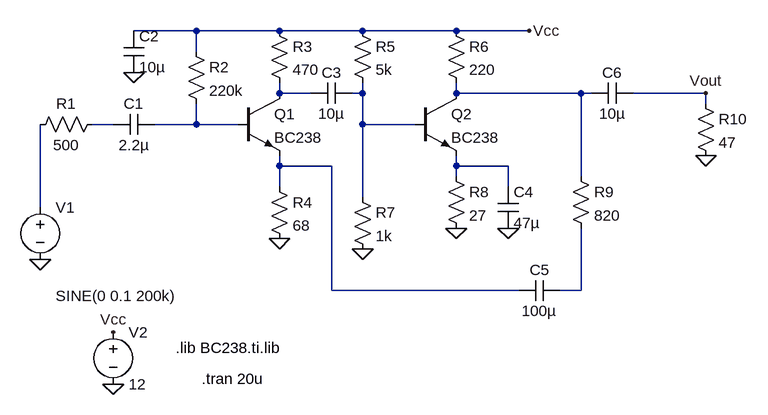
[diagram p0: schematic ECDLab4.asc]
ECDLab4.asc, the LTspice schematic file:
Version 4
SHEET 1 175648 24656
WIRE 174288 24048 174192 24048
WIRE 174416 24048 174288 24048
WIRE 174544 24048 174416 24048
WIRE 174688 24048 174544 24048
WIRE 174800 24048 174688 24048
WIRE 174288 24080 174288 24048
WIRE 174416 24144 174416 24128
WIRE 174464 24144 174416 24144
WIRE 174544 24144 174544 24128
WIRE 174544 24144 174528 24144
WIRE 174688 24144 174688 24128
WIRE 174880 24144 174688 24144
WIRE 174896 24144 174880 24144
WIRE 175072 24144 174960 24144
WIRE 175072 24160 175072 24144
WIRE 174160 24192 174128 24192
WIRE 174288 24192 174288 24160
WIRE 174288 24192 174224 24192
WIRE 174352 24192 174288 24192
WIRE 174544 24192 174544 24144
WIRE 174624 24192 174544 24192
WIRE 174416 24256 174416 24240
WIRE 174496 24256 174416 24256
WIRE 174688 24256 174688 24240
WIRE 174768 24256 174688 24256
WIRE 174688 24272 174688 24256
WIRE 174880 24272 174880 24144
WIRE 174416 24288 174416 24256
WIRE 174768 24288 174768 24256
WIRE 174544 24304 174544 24192
WIRE 174048 24320 174048 24192
WIRE 174496 24448 174496 24256
WIRE 174784 24448 174496 24448
WIRE 174880 24448 174880 24352
WIRE 174880 24448 174848 24448
FLAG 174192 24112 0
FLAG 174416 24368 0
FLAG 174544 24384 0
FLAG 174768 24352 0
FLAG 174688 24352 0
FLAG 175072 24144 Vout
FLAG 174800 24048 Vcc
FLAG 174160 24592 0
FLAG 174160 24512 Vcc
FLAG 175072 24240 0
FLAG 174048 24400 0
SYMBOL res 174144 24176 R90
WINDOW 0 0 56 VBottom 2
WINDOW 3 32 56 VTop 2
SYMATTR InstName R1
SYMATTR Value 500
SYMBOL cap 174224 24176 R90
WINDOW 0 0 32 VBottom 2
WINDOW 3 32 32 VTop 2
SYMATTR InstName C1
SYMATTR Value 2.2µ
SYMBOL cap 174176 24048 R0
SYMATTR InstName C2
SYMATTR Value 10µ
SYMBOL res 174400 24032 R0
SYMATTR InstName R3
SYMATTR Value 470
SYMBOL npn 174352 24144 R0
SYMATTR InstName Q1
SYMATTR Value BC238
SYMBOL res 174400 24272 R0
SYMATTR InstName R4
SYMATTR Value 68
SYMBOL cap 174528 24128 R90
WINDOW 0 0 32 VBottom 2
WINDOW 3 32 32 VTop 2
SYMATTR InstName C3
SYMATTR Value 10µ
SYMBOL res 174528 24032 R0
SYMATTR InstName R5
SYMATTR Value 5k
SYMBOL res 174672 24032 R0
SYMATTR InstName R6
SYMATTR Value 220
SYMBOL npn 174624 24144 R0
SYMATTR InstName Q2
SYMATTR Value BC238
SYMBOL res 174528 24288 R0
SYMATTR InstName R7
SYMATTR Value 1k
SYMBOL res 174672 24256 R0
SYMATTR InstName R8
SYMATTR Value 27
SYMBOL cap 174752 24288 R0
SYMATTR InstName C4
SYMATTR Value 47µ
SYMBOL cap 174960 24128 R90
WINDOW 0 0 32 VBottom 2
WINDOW 3 32 32 VTop 2
SYMATTR InstName C6
SYMATTR Value 10µ
SYMBOL voltage 174160 24496 R0
WINDOW 123 0 0 Left 0
WINDOW 39 0 0 Left 0
SYMATTR InstName V2
SYMATTR Value 12
SYMBOL cap 174848 24432 R90
WINDOW 0 0 32 VBottom 2
WINDOW 3 32 32 VTop 2
SYMATTR InstName C5
SYMATTR Value 100µ
SYMBOL res 174864 24256 R0
SYMATTR InstName R9
SYMATTR Value 820
SYMBOL res 175056 24144 R0
SYMATTR InstName R10
SYMATTR Value 47
SYMBOL voltage 174048 24304 R0
WINDOW 3 24 152 Left 2
WINDOW 123 24 180 Left 2
WINDOW 39 0 0 Left 0
SYMATTR Value SINE(0 0.1 200k)
SYMATTR InstName V1
SYMBOL res 174272 24064 R0
SYMATTR InstName R2
SYMATTR Value 220k
TEXT 174256 24536 Left 2 !.lib BC238.ti.lib
TEXT 174296 24584 Left 2 !.tran 20u

The netlist it stands for:
* ECDLab4.asc
R1 N004 N008 500
C1 N005 N004 2.2µ
C2 Vcc 0 10µ
R3 Vcc N001 470
Q1 N001 N005 N006 0 BC238
R4 N006 0 68
C3 N002 N001 10µ
R5 Vcc N002 5k
R6 Vcc N003 220
Q2 N003 N002 N007 0 BC238
R7 N002 0 1k
R8 N007 0 27
C4 N007 0 47µ
C6 Vout N003 10µ
V2 Vcc 0 12
C5 N009 N006 100µ
R9 N003 N009 820
R10 Vout 0 47
V1 N008 0 SINE(0 0.1 200k)
R2 Vcc N005 220k
.model NPN NPN
.model PNP PNP
.lib standard.bjt
.lib BC238.ti.lib
.tran 20u
.backanno
.end